# Altium schematic sheet Input_Selection.SchDoc: Input Selection
size A4; DrawnBy: Sem Kirkels; DocumentNumber: 22-23P01S04; Revision: V1; SheetNumber: 4; SheetTotal: 5
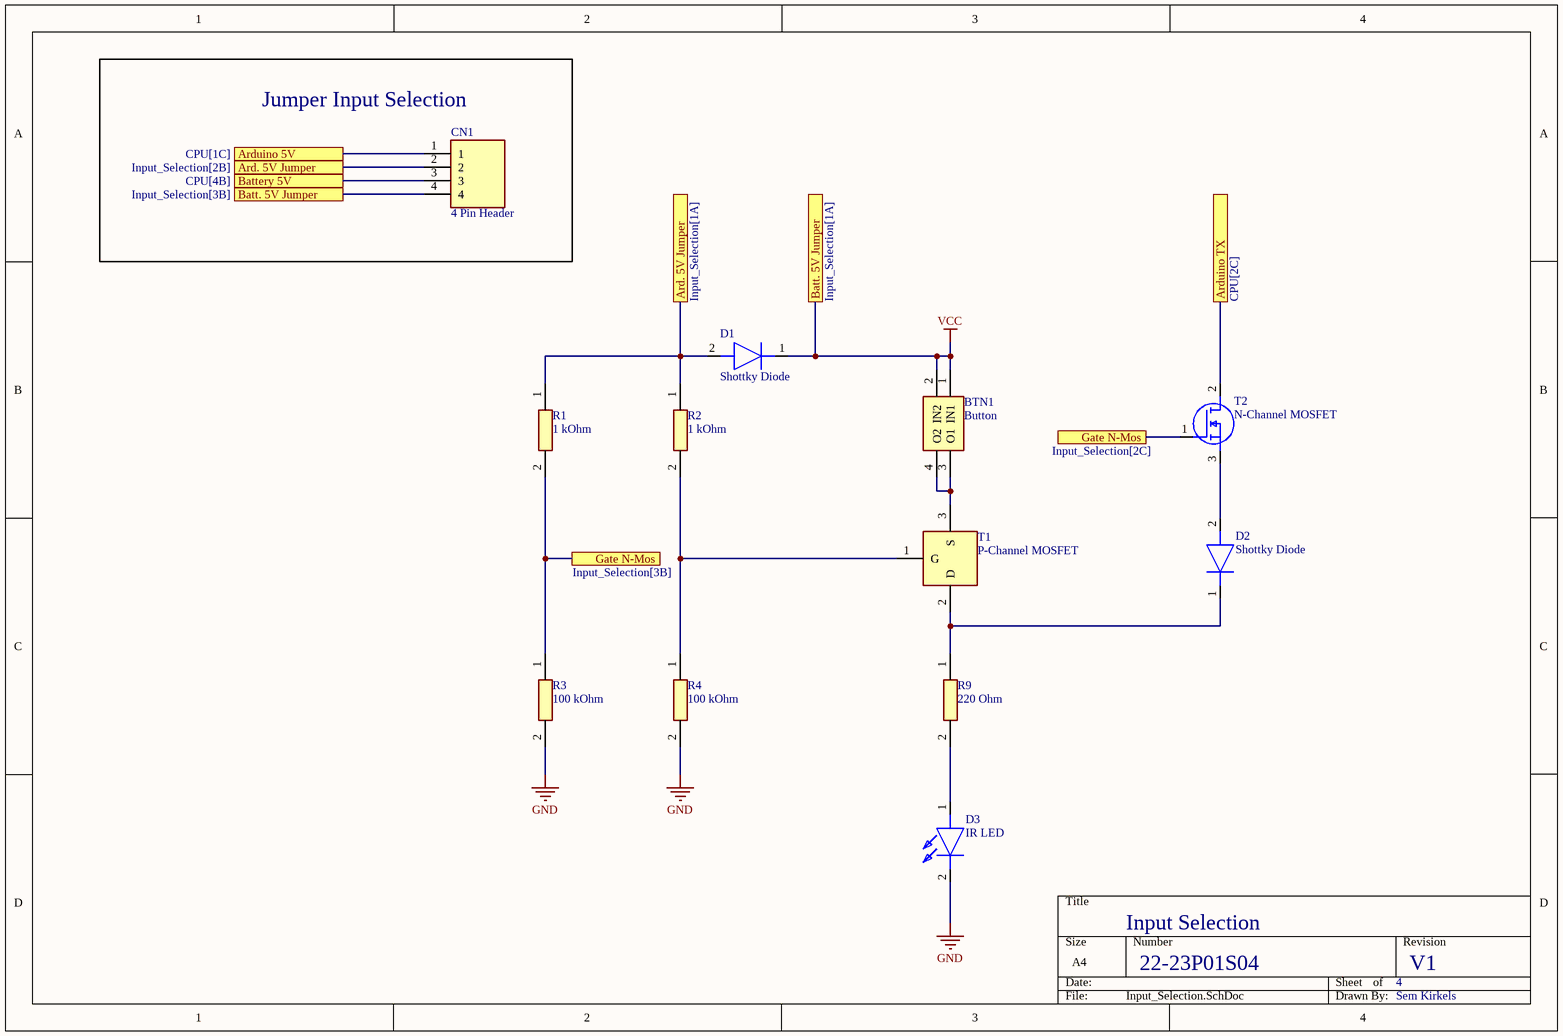
[diagram p0: Input_Selection.SchDoc]

## Parts
BTN1  Button  [PushButton]
CN1  4 Pin Header  [4 PIN HEADER]
D1  Shottky Diode  [Zener Diode]
D2  Shottky Diode  [Zener Diode]
D3  IR LED  [ELIR204H16L10]
R1  1 kOhm  [0805]
R2  1 kOhm  [0805]
R3  100 kOhm  [0805]
R4  100 kOhm  [0805]
R9  220 Ohm  [0805]
T1  P-Channel MOSFET  [TO254P469X1042X1967-3P]
T2  N-Channel MOSFET  [N-MOS]

## Blocks framed on the sheet
Jumper Input Selection: CN1

## Ports
Ard. 5V Jumper (see Input_Selection[1A]), Ard. 5V Jumper (see Input_Selection[2B]), Arduino 5V (see CPU[1C]), Arduino TX (see CPU[2C]), Batt. 5V Jumper (see Input_Selection[1A]), Batt. 5V Jumper (see Input_Selection[3B]), Battery 5V (see CPU[4B]), Gate N-Mos (see Input_Selection[2C]), Gate N-Mos (see Input_Selection[3B])

## Nets
GND: D3.2(K) R3.2 R4.2
VCC: BTN1.1(IN1) BTN1.2(IN2) CN1.4 D1.1(K) ; port Batt. 5V Jumper
Ard. 5V Jumper: CN1.2 D1.2(A) R1.1 R2.1 ; port Ard. 5V Jumper
Arduino 5V: CN1.1 ; port Arduino 5V
Arduino TX: T2.2(D) ; port Arduino TX
Battery 5V: CN1.3 ; port Battery 5V
Gate N-Mos: R1.2 R3.1 T2.1(G) ; port Gate N-Mos
NetBTN1_3: BTN1.3(O1) BTN1.4(O2) T1.3(S)
NetD2_1: D2.1(K) R9.1 T1.2(D)
NetD2_2: D2.2(A) T2.3(S)
NetD3_1: D3.1(A) R9.2
NetR2_2: R2.2 R4.1 T1.1(G)

## Library data of the parts
BTN1 = Button: TS02-66-50-BK-100-SCR-D; Manufacturer_Name: CUI Devices; Datasheet Link: https://www.cuidevices.com/product/resource/ts02.pdf; Height: 5.2mm; Manufacturer_Part_Number: TS02-66-50-BK-100-SCR-D; Mouser Part Number: 179-TS026650BK100SCR; Mouser Price/Stock: https://www.mouser.co.uk/ProductDetail/CUI-Devices/TS02-66-50-BK-100-SCR-D?qs=A6eO%252BMLsxmQON%252BZSzpek2A%3D%3D; Arrow Part Number: TS02-66-50-BK-100-SCR-D; Arrow Price/Stock: https://www.arrow.com/en/products/ts02-66-50-bk-100-scr-d/cui-devices?region=nac
CN1 = 4 Pin Header: G800LW304032EU; Manufacturer_Name: Amphenol Communications Solutions; Datasheet Link: https://cdn.amphenol-cs.com/media/wysiwyg/files/drawing/g800lwxxxxxxeu.pdf; Height: 8.63mm; Manufacturer_Part_Number: G800LW304032EU; Mouser Part Number: 523-G800LW304032EU; Mouser Price/Stock: https://www.mouser.com/Search/Refine.aspx?Keyword=523-G800LW304032EU
D1 D2 = Zener Diode: VS-10BQ015-M3_5BT; Manufacturer_Name: Vishay; Manufacturer_Part_Number: VS-10BQ015-M3/5BT; Datasheet Link: https://componentsearchengine.com/Datasheets/2/VS-10BQ015-M3_5BT.pdf; Height: 2.44mm; Mouser Part Number: 78-VS-10BQ015-M35BT; Mouser Price/Stock: https://www.mouser.co.uk/ProductDetail/Vishay-Semiconductors/VS-10BQ015-M3-5BT?qs=asPD7ZL2j3VpzaHhlDLLKA%3D%3D; Arrow Part Number: VS-10BQ015-M3/5BT; Arrow Price/Stock: https://www.arrow.com/en/products/vs-10bq015-m35bt/vishay
D3 = IR LED: LED EL-IR204_H16_L10; Manufacturer_Name: Everlight; Manufacturer_Part_Number: EL-IR204/H16/L10; Datasheet Link: https://www.mouser.de/ProductDetail/Everlight/EL-IR204-H16-L10?qs=vs%252BWWTB4QKYLfZ6uf%2Fu%252B0Q%3D%3D; Height: 7mm; Mouser Part Number: 638-IR204/H16/L10; Mouser Price/Stock: https://www.mouser.co.uk/ProductDetail/Everlight/EL-IR204-H16-L10?qs=vs%252BWWTB4QKYLfZ6uf%2Fu%252B0Q%3D%3D
R1-R4 R9 = Resistor: Manufacturer_Name: YAGEO; Manufacturer_Part_Number: RP0805BRD071KL; Datasheet Link: https://www.yageo.com/upload/media/product/products/datasheet/rchip/PYu-RP_51_RoHS_L_0.pdf; Height: 0.6mm; Mouser Part Number: 603-RP0805BRD071KL; Mouser Price/Stock: https://www.mouser.co.uk/ProductDetail/YAGEO/RP0805BRD071KL?qs=Y0Uzf4wQF3m8mAbG54g63Q%3D%3D
T1 = P-Channel MOSFET: MOSFET (P-Channel)IRF9530NPBF; Manufacturer_Name: Infineon; Datasheet Link: https://www.infineon.com/dgdl/irf9530npbf.pdf?fileId=5546d462533600a401535611b9931dc1; Height: 4.69mm; Manufacturer_Part_Number: IRF9530NPBF; Mouser Part Number: 942-IRF9530NPBF; Mouser Price/Stock: https://www.mouser.co.uk/ProductDetail/Infineon-Technologies/IRF9530NPBF?qs=9%252BKlkBgLFf2oWmEcBf5aZQ%3D%3D; Arrow Part Number: IRF9530NPBF; Arrow Price/Stock: https://www.arrow.com/en/products/irf9530npbf/infineon-technologies-ag?region=europe
T2 = N-Channel MOSFET: MOSFET (N-Channel)IRF540NPBF; Manufacturer_Name: Infineon; Datasheet Link: https://www.infineon.com/dgdl/irf540n.pdf?fileId=5546d462533600a4015355e396cb199f; Height: 4.69mm; Manufacturer_Part_Number: IRF540NPBF; Mouser Part Number: 942-IRF540NPBF; Mouser Price/Stock: https://www.mouser.co.uk/ProductDetail/Infineon-Technologies/IRF540NPBF?qs=9%252BKlkBgLFf36us%252Bg5kwffA%3D%3D; Arrow Part Number: IRF540NPBF; Arrow Price/Stock: https://www.arrow.com/en/products/irf540npbf/infineon-technologies-ag?region=europe